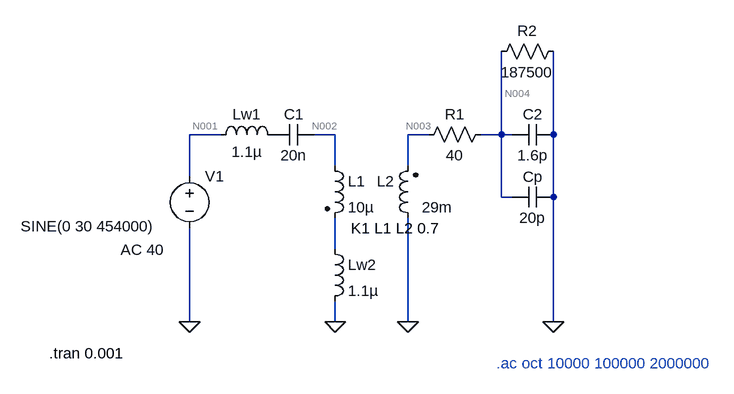
[diagram p0: schematic resonant_H_bridge_old_coil.asc]
resonant_H_bridge_old_coil.asc, the LTspice schematic file:
Version 4
SHEET 1 880 680
WIRE 48 96 0 96
WIRE 224 96 192 96
WIRE 368 96 336 96
WIRE 480 96 480 -32
WIRE 480 96 448 96
WIRE 496 96 480 96
WIRE 560 96 560 -32
WIRE 224 144 224 96
WIRE 336 144 336 96
WIRE 0 160 0 96
WIRE 480 192 480 96
WIRE 496 192 480 192
WIRE 560 192 560 96
WIRE 224 272 224 224
WIRE 0 384 0 240
WIRE 224 384 224 352
WIRE 336 384 336 224
WIRE 560 384 560 192
FLAG 224 384 0
FLAG 0 384 0
FLAG 336 384 0
FLAG 560 384 0
SYMBOL voltage 0 144 R0
WINDOW 123 -106 129 Left 2
WINDOW 39 0 0 Left 0
WINDOW 3 -260 93 Left 2
SYMATTR Value2 AC 40
SYMATTR Value SINE(0 30 454000)
SYMATTR InstName V1
SYMBOL cap 192 80 R90
WINDOW 0 0 31 VBottom 2
WINDOW 3 32 32 VTop 2
SYMATTR InstName C1
SYMATTR Value 20n
SYMBOL ind2 208 128 R0
SYMATTR InstName L1
SYMATTR Value 10µ
SYMATTR Type ind
SYMBOL ind2 352 240 R180
WINDOW 0 37 72 Left 2
WINDOW 3 -53 32 Left 2
SYMATTR InstName L2
SYMATTR Value 29m
SYMATTR Type ind
SYMBOL cap 560 80 R90
WINDOW 0 0 32 VBottom 2
WINDOW 3 32 32 VTop 2
SYMATTR InstName C2
SYMATTR Value 1.6p
SYMBOL res 464 80 R90
WINDOW 0 0 56 VBottom 2
WINDOW 3 32 56 VTop 2
SYMATTR InstName R1
SYMATTR Value 40
SYMBOL res 576 -48 R90
WINDOW 0 0 56 VBottom 2
WINDOW 3 32 56 VTop 2
SYMATTR InstName R2
SYMATTR Value 187500
SYMBOL ind 32 112 R270
WINDOW 0 32 56 VTop 2
WINDOW 3 5 56 VBottom 2
SYMATTR InstName Lw1
SYMATTR Value 1.1µ
SYMBOL ind 208 256 R0
SYMATTR InstName Lw2
SYMATTR Value 1.1µ
SYMBOL cap 560 176 R90
WINDOW 0 0 32 VBottom 2
WINDOW 3 32 32 VTop 2
SYMATTR InstName Cp
SYMATTR Value 20p
TEXT 248 240 Left 2 !K1 L1 L2 0.7
TEXT 472 448 Left 2 ;.ac oct 10000 100000 2000000
TEXT -216 432 Left 2 !.tran 0.001

The netlist it stands for:
* resonant_H_bridge_old_coil.asc
V1 N001 0 SINE(0 30 454000) AC 40
C1 N002 P001 20n
L1 N002 N005 10µ
L2 0 N003 29m
C2 0 N004 1.6p
R1 N004 N003 40
R2 0 N004 187500
Lw1 N001 P001 1.1µ
Lw2 N005 0 1.1µ
Cp 0 N004 20p
K1 L1 L2 0.7
* .ac oct 10000 100000 2000000
.tran 0.001
.backanno
.end

* Results of the author's LTspice run, read from the files saved beside the schematic
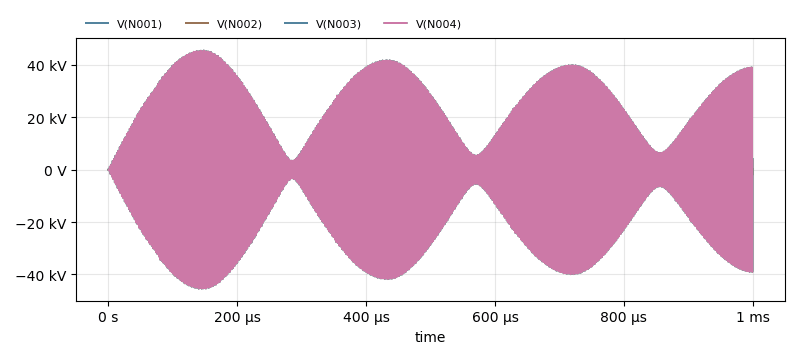
[diagram p1: Transient Analysis of resonant_H_bridge_old_coil.asc, plotted from the saved traces]
* Transient Analysis, 1 run:
*   V(N001): min -30 V, max 30 V, average 189.5 µV, rms 21.38 V, last 0 V
*   V(N002): min -2.518 kV, max 2.52 kV, average -735.7 mV, rms 1.148 kV, last 225.1 V
*   V(N003): min -45.47 kV, max 45.52 kV, average -13.18 V, rms 20.64 kV, last 4.098 kV
*   V(N004): min -45.46 kV, max 45.52 kV, average -13.19 V, rms 20.64 kV, last 4.001 kV